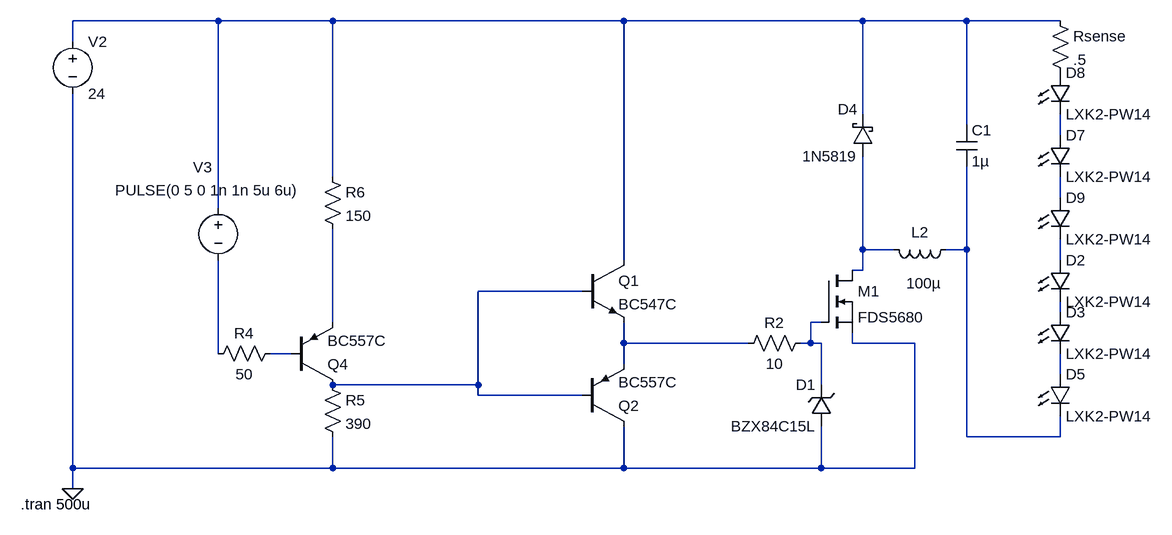
[diagram p0: schematic Buck discrete led driver nchannel III.asc]
Buck discrete led driver nchannel III.asc, the LTspice schematic file:
Version 4
SHEET 1 2900 1860
WIRE -2480 -560 -2704 -560
WIRE -2304 -560 -2480 -560
WIRE -1856 -560 -2304 -560
WIRE -1488 -560 -1856 -560
WIRE -1328 -560 -1488 -560
WIRE -1184 -560 -1328 -560
WIRE -2704 -528 -2704 -560
WIRE -1488 -416 -1488 -560
WIRE -1328 -400 -1328 -560
WIRE -1184 -384 -1184 -416
WIRE -2304 -320 -2304 -560
WIRE -1184 -288 -1184 -320
WIRE -2480 -272 -2480 -560
WIRE -1488 -208 -1488 -352
WIRE -1440 -208 -1488 -208
WIRE -1328 -208 -1328 -336
WIRE -1328 -208 -1360 -208
WIRE -1856 -192 -1856 -560
WIRE -1184 -192 -1184 -224
WIRE -1488 -176 -1488 -208
WIRE -1488 -176 -1504 -176
WIRE -1920 -144 -2080 -144
WIRE -1184 -112 -1184 -128
WIRE -2304 -96 -2304 -240
WIRE -1552 -96 -1568 -96
WIRE -1856 -64 -1856 -96
WIRE -1664 -64 -1856 -64
WIRE -1568 -64 -1568 -96
WIRE -1568 -64 -1584 -64
WIRE -1552 -64 -1568 -64
WIRE -1504 -64 -1504 -80
WIRE -1408 -64 -1504 -64
WIRE -2480 -48 -2480 -192
WIRE -2368 -48 -2400 -48
WIRE -1856 -32 -1856 -64
WIRE -1184 -16 -1184 -48
WIRE -2080 0 -2080 -144
WIRE -2080 0 -2304 0
WIRE -1552 0 -1552 -64
WIRE -2080 16 -2080 0
WIRE -1920 16 -2080 16
WIRE -1328 80 -1328 -208
WIRE -1184 80 -1184 48
WIRE -1184 80 -1328 80
WIRE -2704 128 -2704 -448
WIRE -2304 128 -2304 80
WIRE -2304 128 -2704 128
WIRE -1856 128 -1856 64
WIRE -1856 128 -2304 128
WIRE -1552 128 -1552 64
WIRE -1552 128 -1856 128
WIRE -1408 128 -1408 -64
WIRE -1408 128 -1552 128
WIRE -2704 160 -2704 128
FLAG -2704 160 0
SYMBOL schottky -1472 -352 R180
WINDOW 0 24 72 Left 2
WINDOW 3 24 0 Left 2
SYMATTR InstName D4
SYMATTR Value 1N5819
SYMATTR Description Diode
SYMATTR Type diode
SYMBOL LED -1200 -384 R0
SYMATTR InstName D7
SYMATTR Value LXK2-PW14
SYMATTR Description Diode
SYMATTR Type diode
SYMBOL LED -1200 -480 R0
SYMATTR InstName D8
SYMATTR Value LXK2-PW14
SYMATTR Description Diode
SYMATTR Type diode
SYMBOL LED -1200 -288 R0
SYMATTR InstName D9
SYMATTR Value LXK2-PW14
SYMATTR Description Diode
SYMATTR Type diode
SYMBOL voltage -2704 -544 R0
WINDOW 123 0 0 Left 2
WINDOW 39 0 0 Left 2
SYMATTR InstName V2
SYMATTR Value 24
SYMBOL voltage -2480 -288 R0
WINDOW 123 0 0 Left 2
WINDOW 39 0 0 Left 2
WINDOW 3 -159 -11 Left 2
WINDOW 0 -39 -47 Left 2
SYMATTR Value PULSE(0 5 0 1n 1n 5u 6u)
SYMATTR InstName V3
SYMBOL res -1568 -80 R90
WINDOW 0 0 56 VBottom 2
WINDOW 3 32 56 VTop 2
SYMATTR InstName R2
SYMATTR Value 10
SYMBOL res -1200 -576 R0
SYMATTR InstName Rsense
SYMATTR Value .5
SYMBOL ind -1344 -224 R90
WINDOW 0 5 56 VBottom 2
WINDOW 3 52 50 VTop 2
SYMATTR InstName L2
SYMATTR Value 100µ
SYMATTR SpiceLine Rser=50m
SYMBOL pnp -2368 0 M180
SYMATTR InstName Q4
SYMATTR Value BC557C
SYMBOL res -2320 -16 R0
SYMATTR InstName R5
SYMATTR Value 390
SYMBOL npn -1920 -192 R0
SYMATTR InstName Q1
SYMATTR Value BC547C
SYMBOL pnp -1920 64 M180
SYMATTR InstName Q2
SYMATTR Value BC557C
SYMBOL res -2384 -64 R90
WINDOW 0 0 56 VBottom 2
WINDOW 3 32 56 VTop 2
SYMATTR InstName R4
SYMATTR Value 50
SYMBOL LED -1200 -192 R0
SYMATTR InstName D2
SYMATTR Value LXK2-PW14
SYMATTR Description Diode
SYMATTR Type diode
SYMBOL LED -1200 -112 R0
SYMATTR InstName D3
SYMATTR Value LXK2-PW14
SYMATTR Description Diode
SYMATTR Type diode
SYMBOL res -2320 -336 R0
SYMATTR InstName R6
SYMATTR Value 150
SYMBOL zener -1536 64 R180
WINDOW 0 24 64 Left 2
WINDOW 3 24 0 Left 2
SYMATTR InstName D1
SYMATTR Value BZX84C15L
SYMATTR Description Diode
SYMATTR Type diode
SYMBOL nmos -1552 -176 R0
SYMATTR InstName M1
SYMATTR Value FDS5680
SYMBOL LED -1200 -16 R0
SYMATTR InstName D5
SYMATTR Value LXK2-PW14
SYMATTR Description Diode
SYMATTR Type diode
SYMBOL cap -1344 -400 R0
SYMATTR InstName C1
SYMATTR Value 1µ
SYMATTR SpiceLine Rser=1
TEXT -2784 184 Left 2 !.tran 500u

The netlist it stands for:
* Buck discrete led driver nchannel III.asc
D4 N004 N001 1N5819
D7 N002 N003 LXK2-PW14
D8 P001 N002 LXK2-PW14
D9 N003 N006 LXK2-PW14
V2 N001 0 24
V3 N001 N012 PULSE(0 5 0 1n 1n 5u 6u)
R2 N010 N011 10
Rsense N001 P001 .5
L2 N005 N004 100µ Rser=50m
Q4 N007 N013 N009 0 BC557C
R5 N007 0 390
Q1 N001 N007 N011 0 BC547C
Q2 0 N007 N011 0 BC557C
R4 N013 N012 50
D2 N006 N008 LXK2-PW14
D3 N008 N014 LXK2-PW14
R6 N001 N009 150
D1 0 N010 BZX84C15L
M1 N004 N010 0 0 FDS5680
D5 N014 N005 LXK2-PW14
C1 N001 N005 1µ Rser=1
.model D D
.lib standard.dio
.model NPN NPN
.model PNP PNP
.lib standard.bjt
.model NMOS NMOS
.model PMOS PMOS
.lib standard.mos
.tran 500u
.backanno
.end